# Altium schematic sheet Lcd.SchDoc
size A4; SheetNumber: 3; SheetTotal: 3; SPICEModelCacheGUJJYSLL: <root> / <DocumentId>GUJJYSLL</DocumentId> / <CacheFrame Number="0"> / <Model Name="bat54s" Kind="CKT"> / <Text>* / .SUBCKT BAT54S 1 2 3 / * The resistors do not reflect / * physical devices.  Instead they / * improve modeling in the reverse / * mode of operation. / * / R1 1 3 3.6E+07 / D1 1 3 BAT54S / R2 3 2 3.6E+07 / D2 3 2 BAT54S / * / .MODEL BAT54S D / +( / +    IS = 2.117E-07 / +    N = 1.016 / +    BV = 36 / +    IBV = 1.196E-06 / +    RS = 2.637 / +    CJO = 1.114E-11 / +    VJ = 0.2013 / +    M = 0.3868 / +    FC = 0 / +    TT = 0 / +    EG = 0.69 / +    XTI = 2 / +) / .ENDS</Text> / </Model> / </CacheFrame> / </root>
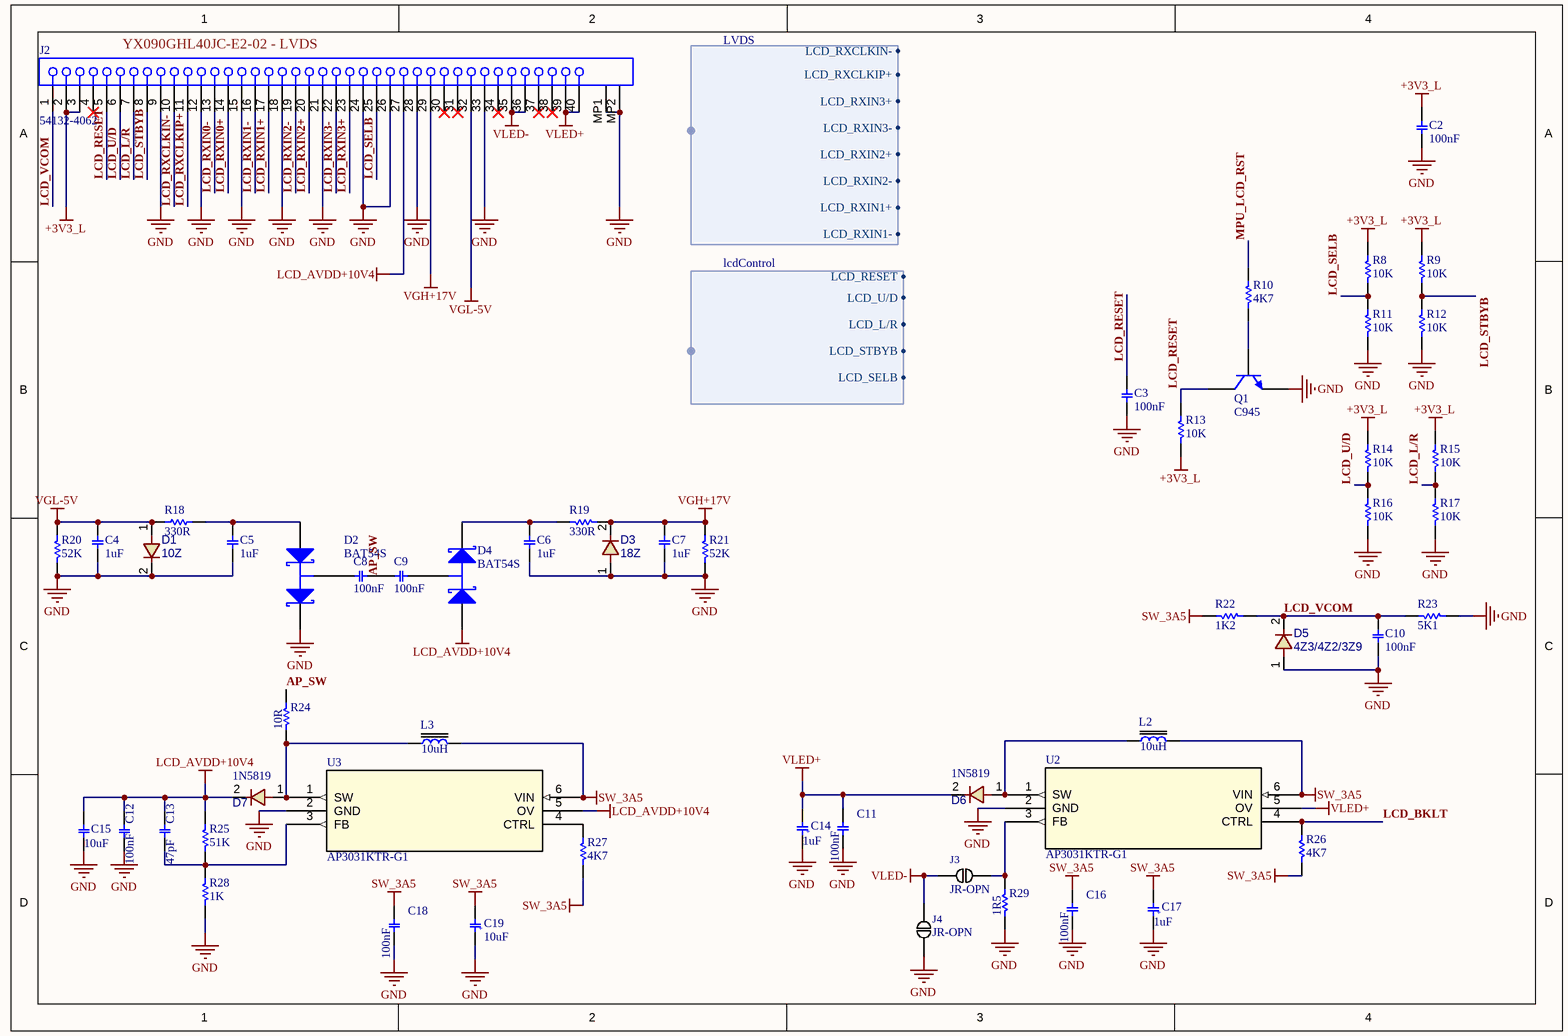
[diagram p0: Lcd.SchDoc]

## Parts
C2  100nF  [C0603E]
C3  100nF  [C0603E]
C4  1uF  [C0603E]
C5  1uF  [C0603E]
C6  1uF  [C0603E]
C7  1uF  [C0603E]
C8  100nF  [C0603E]
C9  100nF  [C0603E]
C10  100nF  [C0603E]
C11  100nF  [C0603E]
C12  100nF  [C0603E]
C13  47pF  [C0603E]
C14  1uF  [Cap_A]
C15  10uF  [C0603E]
C16  100nF  [C0603E]
C17  1uF  [Cap_A]
C18  100nF  [C0603E]
C19  10uF  [Cap_A]
D1  10Z  [D_SOD80]
D2  BAT54S  [SOT-23]
D3  18Z  [D_SOD80]
D4  BAT54S  [SOT-23]
D5  4Z3/4Z2/3Z9  [D_SOD80]
D6  value 1N5819  [D_SMA]  (hidden comment: 1N5819 SMD SS31)
D7  value 1N5819  [D_SMA]  (hidden comment: 1N5819 SMD SS31)
J2  54132-4062  [MOLX-54132-4062]
J3  JR-OPN
J4  JR-OPN
L2  10uH  [L_XAL1010]
L3  10uH  [L_XAL1010]
Q1  C945  [SOT23_N]
R8  10K  [R0603O]
R9  10K  [R0603O]
R10  4K7  [R0603O]
R11  10K  [R0603O]
R12  10K  [R0603O]
R13  10K  [R0603O]
R14  10K  [R0603O]
R15  10K  [R0603O]
R16  10K  [R0603O]
R17  10K  [R0603O]
R18  330R  [R0603O]
R19  330R  [R0603O]
R20  52K  [R0603O]
R21  52K  [R0603O]
R22  1K2  [R0603O]
R23  5K1  [R0603O]
R24  10R  [R0603O]
R25  51K  [R0603O]
R26  4K7  [R0603O]
R27  4K7  [R0603O]
R28  1K  [R0603O]
R29  1R5  [R0603O]
U2  AP3031KTR-G1  [SOT23-6_DIO]
U3  AP3031KTR-G1  [SOT23-6_DIO]

## Harnesses
LVDS: LCD_RXCLKIN-, LCD_RXCLKIP+, LCD_RXIN3+, LCD_RXIN3-, LCD_RXIN2+, LCD_RXIN2-, LCD_RXIN1+, LCD_RXIN1-
lcdControl: LCD_RESET, LCD_U/D, LCD_L/R, LCD_STBYB, LCD_SELB

## Nets
+3V3_L: C2.2 J2.2 J2.3 R8.1 R9.1 R13.2 R14.1 R15.1
GND: C2.1 C3.1 C4.1 C5.1 C6.1 C7.1 C10.1 C11.1 C12.1 C14.2 C15.1 C16.1 C17.2 C18.1 C19.2 D1.2 D2.2(K) D3.1 D5.1 J2.9 J2.12 J2.15 J2.18 J2.21 J2.24 J2.26 J2.28 J2.33 J2.MP1 J2.MP2 J4.2 Q1.2(E) R11.2 R12.1 R16.2 R17.2 R20.1 R21.1 R23.1 R28.1 R29.1 U2.2(GND) U3.2(GND)
LCD_AVDD+10V4: C12.2 C13.2 C15.2 D4.1(A) D7.2 J2.27 R25.2 U3.5(OV)
SW_3A5: C16.2 C17.1 C18.2 C19.1 L2.2 L3.2 R22.2 R26.1 R27.1 U2.6(VIN) U3.6(VIN)
VGH+17V: C7.2 D3.2 J2.29 R19.1 R21.2
VGL-5V: C4.2 D1.1 J2.32 R18.1 R20.2
VLED+: C11.2 C14.1 D6.2 J2.39 J2.40 U2.5(OV)
VLED-: J2.35 J2.36 J3.1 J4.1
AP_SW: C8.1 C9.2 R24.2
LCD_BKLT: R26.2 U2.4(CTRL)
LCD_L/R: J2.7 R15.2 R17.1
LCD_RESET: C3.2 J2.5 Q1.3(C) R13.1
LCD_RXCLKIN-: J2.10
LCD_RXCLKIP+: J2.11
LCD_RXIN0+: J2.14
LCD_RXIN0-: J2.13
LCD_RXIN1+: J2.17
LCD_RXIN1-: J2.16
LCD_RXIN2+: J2.20
LCD_RXIN2-: J2.19
LCD_RXIN3+: J2.23
LCD_RXIN3-: J2.22
LCD_SELB: J2.25 R8.2 R11.1
LCD_STBYB: J2.8 R9.2 R12.2
LCD_U/D: J2.6 R14.2 R16.1
LCD_VCOM: C10.2 D5.2 J2.1 R22.1 R23.2
MPU_LCD_RST: R10.1
NetC5_2: C5.2 D2.1(A) R18.2
NetC6_2: C6.2 D4.2(K) R19.2
NetC8_2: C8.2 D2.3(C)
NetC9_1: C9.1 D4.3(C)
NetC13_1: C13.1 R25.1 R28.2 U3.3(FB)
NetD6_1: D6.1 L2.1 U2.1(SW)
NetD7_1: D7.1 L3.1 R24.1 U3.1(SW)
NetJ3_2: J3.2 R29.2 U2.3(FB)
NetQ1_1: Q1.1(B) R10.2
NetR27_2: R27.2 U3.4(CTRL)

Not connected (* = marked no-connect by the designer): J2 4* 30* 31* 34* 37* 38*

## Notes on the sheet
- (near J2) YX090GHL40JC-E2-02 - LVDS
- THIS DOCUMENT AND THE DATA DISCLOSED HEREIN OR
- HEREWITH IS THE PROPERTY OF ALTIUM LIMITED AND MAY
- DWG NO:
- REVISION
- REV:
- DESCRIPTION
- DATE
- APPROVED
- BE FREELY DISTRIBUTED IN WHOLE. NO RIGHTS ARE
- RESERVED OR EXPRESS OR IMPLIED WARANTEE GIVEN.
- ENG:
- APPROVALS
- PROJECT
- DSN:
- CHK:
- REFERENCE DOCUMENTS
- PROJECT REVISION:
- TITLE
- DOCUMENT REVISION:
- DESIGN ITEM:
- BOM:
- FAB DWG:
- PCB DWG:
- ASSY DWG:
- SCALE:
- A3
- SIZE
- CAGE CODE
- FILE NAME
- DWG NO.
- SHEET
- OF
- REV
- (in symbol Capacitor Tantalum SMD) +

## Library data of the parts
C2-C12 C15 C16 C18 = Capacitor C SMD 0603
  C2 C3 C8-C12 C16 C18: DatasheetVersion: 2021; ComponentLink1Description: Website Smart World; ComponentLink1URL: https://www.smartw.ir/; ComponentLink2Description: Telegram; ComponentLink2URL: https://t.me/altium_smartw; ComponentLink3Description: Instagram; ComponentLink3URL: https://Instagram.com/smartgw.ir; Value: 100nf
C13 = Capacitor C SMD 0603: Value: 100nf; DatasheetVersion: 2021; ComponentLink1Description: Website Smart World; ComponentLink1URL: https://www.smartw.ir/; ComponentLink2Description: Telegram; ComponentLink2URL: https://t.me/altium_smartw; ComponentLink3Description: Instagram; ComponentLink3URL: https://Instagram.com/smartgw.ir
C14 C17 C19 = Capacitor Tantalum SMD: DatasheetVersion: 2021; ComponentLink1Description: Website Smart World; ComponentLink1URL: https://www.smartw.ir/; ComponentLink2Description: Telegram; ComponentLink2URL: https://t.me/altium_smartw; ComponentLink3Description: Instagram; ComponentLink3URL: https://Instagram.com/smartgw.ir
  C19: Value: 10uF
D1 D3 D5 = 1N4148 SMD: DIODE, FAST SWTICHING, 0.3A, 0.5W
D2 D4 = BAT54S: Schottky Barrier Double Diode; Published: 17-Sep-2003; LatestRevisionDate: 12-Dec-2006; LatestRevisionNote: IPC-7351 Footprint Added.; DatasheetVersion: 4-Mar-2002; PackageVersion: May-1999; PackageReference: SOT23; Publisher: Altium Limited; PackageDescription: 3-Pin SOT-23 Package 0.95 mm Pitch, 2.3 mm Lead Span; ComponentLink1Description: Manufacturer Link; ComponentLink1URL: http://www.semiconductors.philips.com/; ComponentLink2Description: Datasheet; ComponentLink2URL: http://www.semiconductors.philips.com/acrobat/datasheets/BAT54_SERIES_4.pdf
D6 D7 = 1N4007 SMD M7: DIODE, GENERAL PURPOSE, 1000V/1A; DatasheetVersion: 2021; ComponentLink1Description: Website Smart World; ComponentLink1URL: https://www.smartw.ir/; ComponentLink2Description: Telegram; ComponentLink2URL: https://t.me/altium_smartw; ComponentLink3Description: Instagram; ComponentLink3URL: https://Instagram.com/smartgw.ir
J2 = 54132-4062: 0.5 mm Pitch Easy-On(TM) Type FPC Connector, 2.0 mm Mated Height, Right Angle, ZIF, SMT, Bottom Contact, 40 Circuits, -20 to 85 degC, ELV and RoHS Compliant, Tape and Reel; Manufacturer: Molex; Circuits (Loaded): 40; Current (Max per Contact): 0.5A; Durability (mating cycles max): 20; Entry Angle: 90degrees Angle; Mated Height: 2.00mm; Material - Metal: Phosphor Bronze; Material - Plating Mating: Gold; PCB Locator: No; PCB Retention: Yes; Pitch - Mating Interface: 0.50mm; Voltage (Max): 50V; PackageVersion: Rev. F, 07/2010; PackageReference: 54132-4062; PackageDescription: 40-Lead FPC Connector, Pitch 0.5 mm; Supplier 1: Mouser; Supplier Part Number 1: 538-54132-4062; Contact Position: Bottom; Material - Plating Termination: Gold; Number of Rows: 1; Orientation: Right Angle; Packing: Tape and Reel; Polarized to PCB: Yes; RoHS: TRUE; Stackable: No; Mounting Technology: Surface Mount; PartNumber: 54132-4062; ComponentLink1Description: Manufacturer URL; ComponentLink1URL: http://www.molex.com/molex/index.jsp; ComponentLink2Description: Datasheet; ComponentLink2URL: http://www.molex.com/webdocs/datasheets/pdf/en-us/0541324062_FFC_FPC_CONNECTORS.pdf; ComponentLink3Description: Package Specification; ComponentLink3URL: http://www.molex.com/pdm_docs/sd/541324062_sd.pdf
J3 J4 = BYPASS: SOLDERDOT BYPASS; Manufacturer Part Number 1: Board Feature; Reel: Open; Supplier 1: Solder-it-yourself; Manufacturer 1: Board feature
L2 L3 = Inductor SMD Cored 2: ComponentLink1Description: Website Smart World; ComponentLink1URL: https://www.smartw.ir/; ComponentLink2Description: Telegram; ComponentLink2URL: https://t.me/altium_smartw; ComponentLink3Description: Instagram; ComponentLink3URL: https://Instagram.com/smartgw.ir; DatasheetVersion: 2021; Value: 10uH
Q1 = C945: NPN Silicon Epitaxial Planar Transistor; Published: 2017-2-8; LatestRevisionDate: 2017; LatestRevisionNote: IPC-7351 Footprint Added.; DatasheetVersion: 2017; PackageVersion: 2017-2-8; PackageReference: SOT23; Publisher: Abbas Basereh; PackageDescription: 3-Pin SOT-23 Package 0.95 mm Pitch, 2.3 mm Lead Span; ComponentLink1Description: Manufacturer Link; ComponentLink1URL: http://www.taitroncomponents.com/; ComponentLink2Description: Datasheet; ComponentLink2URL: http://www.taitroncomponents.com/
R8-R29 = Resistor SMD 0603
  R18 R19 R24 R29: DatasheetVersion: 2021
U2 U3 = AP3031KTR-G1: No Description Available; Mfr_Name: Diodes Inc; Copyright: Copyright (C) 2022 Ultra Librarian. All rights reserved.; Manufacturer_Part_Number: AP3031KTR-G1; RefDes: RefDes; Type: DEV